# Altium schematic sheet Sheet_1_2021-12-29.schdoc
size 49 x 45 mm
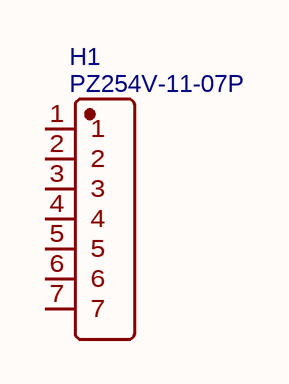
[diagram p0: Sheet_1_2021-12-29.schdoc]

## Parts
H1  PZ254V-11-07P  [HDR-TH_7P-P2.54-V-M]

## Nets

Not connected (* = marked no-connect by the designer): H1 1 2 3 4 5 6 7

## Library data of the parts
H1 = PZ254V-11-07P: BOM_Manufacturer: XFCN; Contributor: LCSC; BOM_Supplier: LCSC; BOM_Supplier Part: C492406; BOM_Manufacturer Part: PZ254V-11-07P; BOM_JLCPCB Part Class: Extended Part; spicePre: H; spiceSymbolName: PZ254V-11-07P